# EAGLE design LOLRGB_3 (EAGLE 7.2.0)
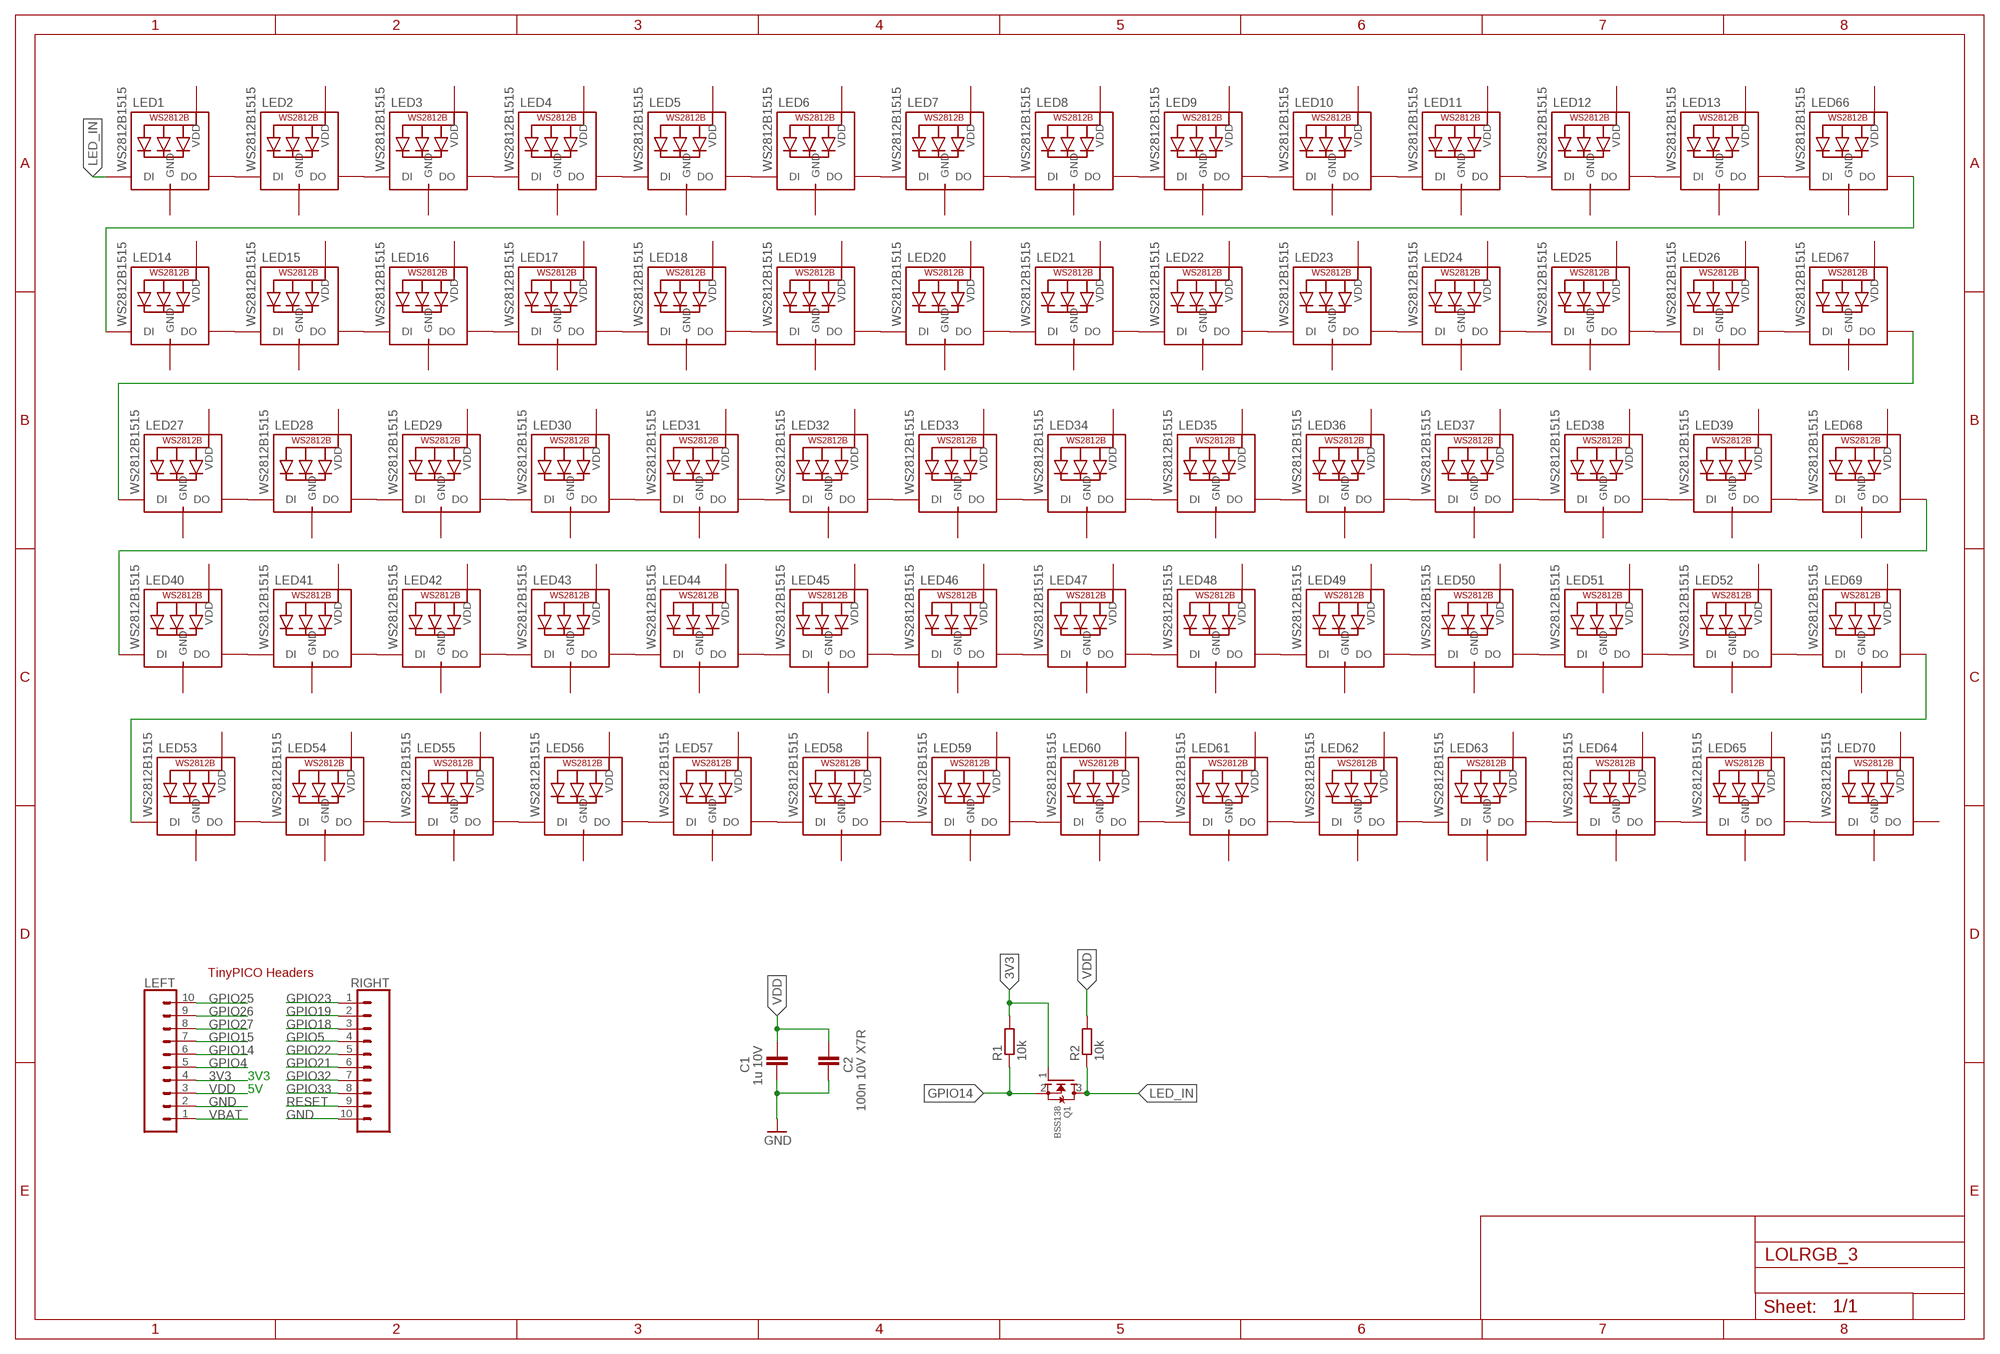
[diagram p0: schematic, sheet 1]

## Parts
C1  1u 10V  C-EUC0402_VISHAY  [C0402-VISHAY]
C2  100n 10V X7R  C-EUC0402_VISHAY  [C0402-VISHAY]
LED1  WS2812B1515  [LED1515]
LED2  WS2812B1515  [LED1515]
LED3  WS2812B1515  [LED1515]
LED4  WS2812B1515  [LED1515]
LED5  WS2812B1515  [LED1515]
LED6  WS2812B1515  [LED1515]
LED7  WS2812B1515  [LED1515]
LED8  WS2812B1515  [LED1515]
LED9  WS2812B1515  [LED1515]
LED10  WS2812B1515  [LED1515]
LED11  WS2812B1515  [LED1515]
LED12  WS2812B1515  [LED1515]
LED13  WS2812B1515  [LED1515]
LED14  WS2812B1515  [LED1515]
LED15  WS2812B1515  [LED1515]
LED16  WS2812B1515  [LED1515]
LED17  WS2812B1515  [LED1515]
LED18  WS2812B1515  [LED1515]
LED19  WS2812B1515  [LED1515]
LED20  WS2812B1515  [LED1515]
LED21  WS2812B1515  [LED1515]
LED22  WS2812B1515  [LED1515]
LED23  WS2812B1515  [LED1515]
LED24  WS2812B1515  [LED1515]
LED25  WS2812B1515  [LED1515]
LED26  WS2812B1515  [LED1515]
LED27  WS2812B1515  [LED1515]
LED28  WS2812B1515  [LED1515]
LED29  WS2812B1515  [LED1515]
LED30  WS2812B1515  [LED1515]
LED31  WS2812B1515  [LED1515]
LED32  WS2812B1515  [LED1515]
LED33  WS2812B1515  [LED1515]
LED34  WS2812B1515  [LED1515]
LED35  WS2812B1515  [LED1515]
LED36  WS2812B1515  [LED1515]
LED37  WS2812B1515  [LED1515]
LED38  WS2812B1515  [LED1515]
LED39  WS2812B1515  [LED1515]
LED40  WS2812B1515  [LED1515]
LED41  WS2812B1515  [LED1515]
LED42  WS2812B1515  [LED1515]
LED43  WS2812B1515  [LED1515]
LED44  WS2812B1515  [LED1515]
LED45  WS2812B1515  [LED1515]
LED46  WS2812B1515  [LED1515]
LED47  WS2812B1515  [LED1515]
LED48  WS2812B1515  [LED1515]
LED49  WS2812B1515  [LED1515]
LED50  WS2812B1515  [LED1515]
LED51  WS2812B1515  [LED1515]
LED52  WS2812B1515  [LED1515]
LED53  WS2812B1515  [LED1515]
LED54  WS2812B1515  [LED1515]
LED55  WS2812B1515  [LED1515]
LED56  WS2812B1515  [LED1515]
LED57  WS2812B1515  [LED1515]
LED58  WS2812B1515  [LED1515]
LED59  WS2812B1515  [LED1515]
LED60  WS2812B1515  [LED1515]
LED61  WS2812B1515  [LED1515]
LED62  WS2812B1515  [LED1515]
LED63  WS2812B1515  [LED1515]
LED64  WS2812B1515  [LED1515]
LED65  WS2812B1515  [LED1515]
LED66  WS2812B1515  [LED1515]
LED67  WS2812B1515  [LED1515]
LED68  WS2812B1515  [LED1515]
LED69  WS2812B1515  [LED1515]
LED70  WS2812B1515  [LED1515]
LEFT  TINYPICO_HEADER_10NO_SILK_PTH_FEMALE  [1X10_NO_SILK]
Q1  BSS138  MOSFET-NSOT23R  [SOT23-R]
R1  10k  R-EU_R0402-VISHAY  [ADAFRUIT_R0402-VISHAY]
R2  10k  R-EU_R0402-VISHAY  [ADAFRUIT_R0402-VISHAY]
RIGHT  TINYPICO_HEADER_10NO_SILK_PTH_FEMALE  [1X10_NO_SILK]

## Nets
3V3: LEFT.4 Q1.1(G) R1.2
GND: C1.2 C2.2 LEFT.2 RIGHT.10
GPIO4: LEFT.5
GPIO5: RIGHT.4
GPIO14: LEFT.6 Q1.2(S) R1.1
GPIO15: LEFT.7
GPIO18: RIGHT.3
GPIO19: RIGHT.2
GPIO21: RIGHT.6
GPIO22: RIGHT.5
GPIO23: RIGHT.1
GPIO25: LEFT.10
GPIO26: LEFT.9
GPIO27: LEFT.8
GPIO32: RIGHT.7
GPIO33: RIGHT.8
LED_IN: LED1.DIN(DI) Q1.3(D) R2.1
N$1: LED13.DOUT(DO) LED66.DIN(DI)
N$2: LED1.DOUT(DO) LED2.DIN(DI)
N$3: LED2.DOUT(DO) LED3.DIN(DI)
N$4: LED3.DOUT(DO) LED4.DIN(DI)
N$5: LED4.DOUT(DO) LED5.DIN(DI)
N$6: LED5.DOUT(DO) LED6.DIN(DI)
N$7: LED6.DOUT(DO) LED7.DIN(DI)
N$8: LED7.DOUT(DO) LED8.DIN(DI)
N$9: LED8.DOUT(DO) LED9.DIN(DI)
N$10: LED10.DOUT(DO) LED11.DIN(DI)
N$11: LED9.DOUT(DO) LED10.DIN(DI)
N$12: LED11.DOUT(DO) LED12.DIN(DI)
N$13: LED12.DOUT(DO) LED13.DIN(DI)
N$14: LED14.DOUT(DO) LED15.DIN(DI)
N$15: LED15.DOUT(DO) LED16.DIN(DI)
N$16: LED16.DOUT(DO) LED17.DIN(DI)
N$17: LED17.DOUT(DO) LED18.DIN(DI)
N$18: LED18.DOUT(DO) LED19.DIN(DI)
N$19: LED19.DOUT(DO) LED20.DIN(DI)
N$20: LED20.DOUT(DO) LED21.DIN(DI)
N$21: LED21.DOUT(DO) LED22.DIN(DI)
N$22: LED23.DOUT(DO) LED24.DIN(DI)
N$23: LED22.DOUT(DO) LED23.DIN(DI)
N$24: LED24.DOUT(DO) LED25.DIN(DI)
N$25: LED25.DOUT(DO) LED26.DIN(DI)
N$26: LED27.DOUT(DO) LED28.DIN(DI)
N$27: LED28.DOUT(DO) LED29.DIN(DI)
N$28: LED29.DOUT(DO) LED30.DIN(DI)
N$29: LED30.DOUT(DO) LED31.DIN(DI)
N$30: LED31.DOUT(DO) LED32.DIN(DI)
N$31: LED32.DOUT(DO) LED33.DIN(DI)
N$32: LED33.DOUT(DO) LED34.DIN(DI)
N$33: LED34.DOUT(DO) LED35.DIN(DI)
N$34: LED36.DOUT(DO) LED37.DIN(DI)
N$35: LED35.DOUT(DO) LED36.DIN(DI)
N$36: LED37.DOUT(DO) LED38.DIN(DI)
N$37: LED38.DOUT(DO) LED39.DIN(DI)
N$38: LED40.DOUT(DO) LED41.DIN(DI)
N$39: LED41.DOUT(DO) LED42.DIN(DI)
N$40: LED42.DOUT(DO) LED43.DIN(DI)
N$41: LED43.DOUT(DO) LED44.DIN(DI)
N$42: LED44.DOUT(DO) LED45.DIN(DI)
N$43: LED45.DOUT(DO) LED46.DIN(DI)
N$44: LED46.DOUT(DO) LED47.DIN(DI)
N$45: LED47.DOUT(DO) LED48.DIN(DI)
N$46: LED49.DOUT(DO) LED50.DIN(DI)
N$47: LED48.DOUT(DO) LED49.DIN(DI)
N$48: LED50.DOUT(DO) LED51.DIN(DI)
N$49: LED51.DOUT(DO) LED52.DIN(DI)
N$50: LED53.DOUT(DO) LED54.DIN(DI)
N$51: LED54.DOUT(DO) LED55.DIN(DI)
N$52: LED55.DOUT(DO) LED56.DIN(DI)
N$53: LED56.DOUT(DO) LED57.DIN(DI)
N$54: LED57.DOUT(DO) LED58.DIN(DI)
N$55: LED58.DOUT(DO) LED59.DIN(DI)
N$56: LED59.DOUT(DO) LED60.DIN(DI)
N$57: LED60.DOUT(DO) LED61.DIN(DI)
N$58: LED62.DOUT(DO) LED63.DIN(DI)
N$59: LED61.DOUT(DO) LED62.DIN(DI)
N$60: LED63.DOUT(DO) LED64.DIN(DI)
N$61: LED64.DOUT(DO) LED65.DIN(DI)
N$62: LED14.DIN(DI) LED66.DOUT(DO)
N$63: LED26.DOUT(DO) LED67.DIN(DI)
N$64: LED39.DOUT(DO) LED68.DIN(DI)
N$65: LED52.DOUT(DO) LED69.DIN(DI)
N$66: LED65.DOUT(DO) LED70.DIN(DI)
N$67: LED27.DIN(DI) LED67.DOUT(DO)
N$68: LED40.DIN(DI) LED68.DOUT(DO)
N$69: LED53.DIN(DI) LED69.DOUT(DO)
RESET: RIGHT.9
VBAT: LEFT.1
VDD: C1.1 C2.1 LEFT.3 R2.2
Unconnected: LED70.DOUT(DO)

## Notes on the sheet
- TinyPICO Headers
- 3V3
- 5V

## Power pins joined to a net without a drawn wire
GND: LED1.GND LED2.GND LED3.GND LED4.GND LED5.GND LED6.GND LED7.GND LED8.GND LED9.GND LED10.GND LED11.GND LED12.GND LED13.GND LED14.GND LED15.GND LED16.GND LED17.GND LED18.GND LED19.GND LED20.GND LED21.GND LED22.GND LED23.GND LED24.GND LED25.GND LED26.GND LED27.GND LED28.GND LED29.GND LED30.GND LED31.GND LED32.GND LED33.GND LED34.GND LED35.GND LED36.GND LED37.GND LED38.GND LED39.GND LED40.GND LED41.GND LED42.GND LED43.GND LED44.GND LED45.GND LED46.GND LED47.GND LED48.GND LED49.GND LED50.GND LED51.GND LED52.GND LED53.GND LED54.GND LED55.GND LED56.GND LED57.GND LED58.GND LED59.GND LED60.GND LED61.GND LED62.GND LED63.GND LED64.GND LED65.GND LED66.GND LED67.GND LED68.GND LED69.GND LED70.GND
VDD: LED1.VDD LED2.VDD LED3.VDD LED4.VDD LED5.VDD LED6.VDD LED7.VDD LED8.VDD LED9.VDD LED10.VDD LED11.VDD LED12.VDD LED13.VDD LED14.VDD LED15.VDD LED16.VDD LED17.VDD LED18.VDD LED19.VDD LED20.VDD LED21.VDD LED22.VDD LED23.VDD LED24.VDD LED25.VDD LED26.VDD LED27.VDD LED28.VDD LED29.VDD LED30.VDD LED31.VDD LED32.VDD LED33.VDD LED34.VDD LED35.VDD LED36.VDD LED37.VDD LED38.VDD LED39.VDD LED40.VDD LED41.VDD LED42.VDD LED43.VDD LED44.VDD LED45.VDD LED46.VDD LED47.VDD LED48.VDD LED49.VDD LED50.VDD LED51.VDD LED52.VDD LED53.VDD LED54.VDD LED55.VDD LED56.VDD LED57.VDD LED58.VDD LED59.VDD LED60.VDD LED61.VDD LED62.VDD LED63.VDD LED64.VDD LED65.VDD LED66.VDD LED67.VDD LED68.VDD LED69.VDD LED70.VDD

## Library data of the parts
C1 C2 = rcl:C-EU: CAPACITOR, European symbol
LED1-LED70 = adafruit:WS2812B
LEFT RIGHT = UnexpectedMaker:TINYPICO_HEADER_10: Multi connection point. Often used as Generic Header-pin footprint for 0.1 inch spaced/style header connections On any of the 0.1 inch spaced packages, you can populate with these: Break Away Headers - Straight <https://www.sparkfun.com/products/116> (PRT-00116) Break Away Male Headers - Right Angle <https://www.sparkfun.com/products/553> (PRT-00553) Female Headers <https://www.sparkfun.com/products/115> (PRT-00115) Break Away Headers - Machine Pin <https://www.sparkfun.com/products/117> (PRT-00117) Break Away Female Headers - Swiss Machine Pin <https://www.sparkfun.com/products/743> (PRT-00743) Arduino Stackable Header - 10 Pin <https://www.sparkfun.com/products/11376> (PRT-11376) For SCREWTERMINALS and SPRING TERMINALS visit here: Screw Terimnals on SparkFun.com <https://www.sparkfun.com/search/results?term=Screw+Terminals> (5mm/3.5mm/2.54mm spacing) This device is also useful as a general connection point to wire up your design to another part of your project. Our various solder wires solder well into these plated through hole pads. Hook-Up Wire - Assortment (Stranded, 22 AWG) <https://www.sparkfun.com/products/11375> (PRT-11375) Hook-Up Wire - Assortment (Solid Core, 22 AWG) <https://www.sparkfun.com/products/11367> (PRT-11367) View the entire wire category on our website here <https://www.sparkfun.com/categories/141> Special notes: Molex polarized connector foot print use with SKU : PRT-08231 with associated crimp pins and housings. 1MM SMD Version SKU: PRT-10208 NOTES ON THE VARIANTS LOCK and LOCK_LONGPADS... This footprint was designed to help hold the alignment of a through-hole component (i.e. 6-pin header) while soldering it into place. You may notice that each hole has been shifted either up or down by 0.005 of an inch from it's more standard position (which is a perfectly straight line). This slight alteration caused the pins (the squares in the middle) to touch the edges of the holes. Because they are alternating, it causes a "brace" to hold the component in place. 0.005 has proven to be the perfect amount of "off-center" position when using our standard breakaway headers. Although looks a little odd when you look at the bare footprint, once you have a header in there, the alteration is very hard to notice. Also,if you push a header all the way into place, it is covered up entirely on the bottom side.; PROD_ID: CONN-11563
Q1 = adafruit:MOSFET-N: N-Channel Mosfet 2N7002E - 60V 260mA SOT23 [Digikey: 2N7002ET1GOSTR-ND] - REEL BSH103 - 30V 850mA SOT23 [Digikey: 568-5013-1-ND]
R1 R2 = rcl:R-EU_: RESISTOR, European symbol

## Board
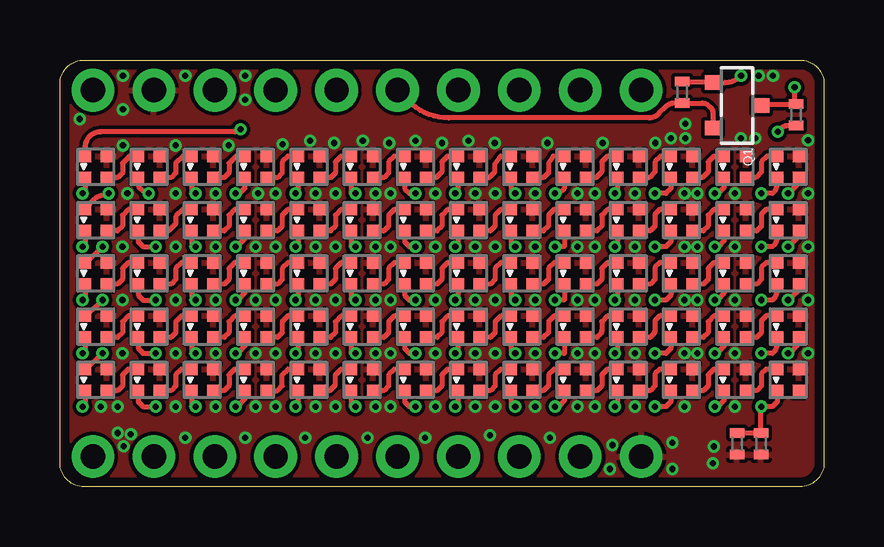
[diagram p1: board, top side]
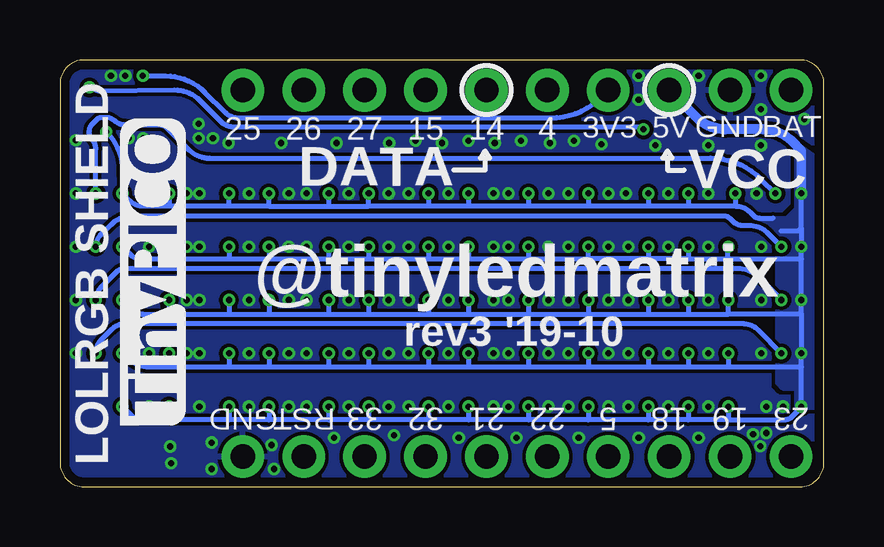
[diagram p2: board, bottom side, seen from below]

Size 31.85 x 17.78 mm. Coordinates in mm from the lower left corner, seen from the top.
Outline: 31.85,16.78 31.85,1 arc-90 30.85,0 1,0 arc-90 0,1 0,16.78 arc-90 1,17.78 30.85,17.78 arc-90 31.85,16.78
Copper layers (1*16): Top 0.035559375mm / dielectric 1.6mm / Bottom 0.035559375mm
Design rules "oshpark-2layer *": minimum track width 6mil, minimum drill 10mil, track to track 6mil, track to pad 6mil, pad to pad 6mil, via to via 6mil, smd to smd 6mil, copper to edge 15mil, drill to drill 6mil, minimum pad ring 5mil, minimum via ring 5mil, stop-mask expansion 2.5mil, vias tented up to drill 10mil, thermal gap 6mil

### Footprints (pad centres in the part's own frame; a part is rotated, then mirrored left to right if it is on the bottom)
C0402-VISHAY = smd 0.4 x 0.6: 1 -0.45,0; 2 0.45,0
LED1515 = smd 0.5 x 0.5: DIN 0.45,0.45; DOUT -0.45,-0.45; GND 0.45,-0.45; VDD -0.45,0.45
1X10_NO_SILK = drill 1.016 pad 1.778: 1 0,0; 2 2.54,0; 3 5.08,0; 4 7.62,0; 5 10.16,0; 6 12.7,0; 7 15.24,0; 8 17.78,0; 9 20.32,0; 10 22.86,0
SOT23-R = smd 0.6 x 0.7: 1 -0.95,-1; 2 0.95,-1; 3 0,1
ADAFRUIT_R0402-VISHAY = smd 0.4 x 0.6: 1 -0.45,0; 2 0.45,0

### Placement (x,y rotation side)
C1  29.23,1.79 270 top
C2  28.23,1.79 270 top
LED1  1.5,13.33 90 top
LED2  3.72,13.33 90 top
LED3  5.94,13.33 90 top
LED4  8.16,13.33 90 top
LED5  10.38,13.33 90 top
LED6  12.6,13.33 90 top
LED7  14.82,13.33 90 top
LED8  17.04,13.33 90 top
LED9  19.26,13.33 90 top
LED10  21.48,13.33 90 top
LED11  23.7,13.33 90 top
LED12  25.92,13.33 90 top
LED13  28.14,13.33 90 top
LED14  1.5,11.11 90 top
LED15  3.72,11.11 90 top
LED16  5.94,11.11 90 top
LED17  8.16,11.11 90 top
LED18  10.38,11.11 90 top
LED19  12.6,11.11 90 top
LED20  14.82,11.11 90 top
LED21  17.04,11.11 90 top
LED22  19.26,11.11 90 top
LED23  21.48,11.11 90 top
LED24  23.7,11.11 90 top
LED25  25.92,11.11 90 top
LED26  28.14,11.11 90 top
LED27  1.5,8.89 90 top
LED28  3.72,8.89 90 top
LED29  5.94,8.89 90 top
LED30  8.16,8.89 90 top
LED31  10.38,8.89 90 top
LED32  12.6,8.89 90 top
LED33  14.82,8.89 90 top
LED34  17.04,8.89 90 top
LED35  19.26,8.89 90 top
LED36  21.48,8.89 90 top
LED37  23.7,8.89 90 top
LED38  25.92,8.89 90 top
LED39  28.14,8.89 90 top
LED40  1.5,6.67 90 top
LED41  3.72,6.67 90 top
LED42  5.94,6.67 90 top
LED43  8.16,6.67 90 top
LED44  10.38,6.67 90 top
LED45  12.6,6.67 90 top
LED46  14.82,6.67 90 top
LED47  17.04,6.67 90 top
LED48  19.26,6.67 90 top
LED49  21.48,6.67 90 top
LED50  23.7,6.67 90 top
LED51  25.92,6.67 90 top
LED52  28.14,6.67 90 top
LED53  1.5,4.45 90 top
LED54  3.72,4.45 90 top
LED55  5.94,4.45 90 top
LED56  8.16,4.45 90 top
LED57  10.38,4.45 90 top
LED58  12.6,4.45 90 top
LED59  14.82,4.45 90 top
LED60  17.04,4.45 90 top
LED61  19.26,4.45 90 top
LED62  21.48,4.45 90 top
LED63  23.7,4.45 90 top
LED64  25.92,4.45 90 top
LED65  28.14,4.45 90 top
LED66  30.36,13.33 90 top
LED67  30.36,11.11 90 top
LED68  30.36,8.89 90 top
LED69  30.36,6.67 90 top
LED70  30.36,4.45 90 top
LEFT  1.37,16.52 0 top
Q1  28.23,15.89 270 top
R1  25.94,16.43 90 top
R2  30.69,15.49 270 top
RIGHT  1.37,1.26 0 top

### Tracks (layer width: path | path; a pad name or v marks a point on that pad's centre or on a via)
3V3  (via drill 0.25)
  Top 0.2: R1.2 27.17,16.88 Q1.1 27.72,16.84 arc45 v28.4,17.12
  Bottom 0.2: v28.4,17.12 27.45,17.12 arc45 25.81,16.44 24.98,15.6 arc-45 24.4,15.37 11.41,15.37 arc-45 9.26,16.26 LEFT.4
GND  (via drill 0.25 pad 0.5, 0.25 pad 0.51)
  other vias: 28.14,10 31.19,10 26.04,10 23.97,10 21.58,10 19.81,10 19.81,12.22 21.58,12.22 23.97,12.22 26.04,12.22 28.14,12.22 28.14,7.78 31.19,7.78 31.19,12.22 31.19,5.56 28.14,5.56 26.04,5.56 23.97,5.56 21.58,5.56 19.81,5.56 17.31,5.56 15.65,5.56 13.15,5.56 11.49,5.56 8.16,5.56 6.49,5.56 4.83,5.56 4.83,7.78 6.49,7.78 8.99,7.78 11.49,7.78 13.15,7.78 15.65,7.78 17.31,7.78 19.81,7.78 21.58,7.78 23.97,7.78 26.04,7.78 17.31,10 15.65,10 13.15,10 10.65,10 8.16,10 6.49,10 4.83,10 2.81,12.22 4.83,12.22 6.49,12.22 8.99,12.22 10.65,12.22 13.15,12.22 15.65,12.22 17.31,12.22 8.26,12.22 13.78,12.22 18.15,12.22 22.31,12.22 26.57,12.22 8.99,10 13.78,10 18.15,10 22.31,10 26.57,10 26.57,7.78 22.31,7.78 18.15,7.78 13.78,7.78 8.16,7.78 8.99,5.56 13.78,5.56 18.15,5.56 22.31,5.56 26.57,5.56 11.49,12.22 11.49,10 10.65,5.56 10.65,7.78 2.61,7.78 2.61,10 2.61,5.56 31.19,14.44 15.65,3.34 17.31,3.34 18.15,3.34 19.81,3.34 21.58,3.34 22.31,3.34 23.97,3.34 26.04,3.34 28.14,3.34 27.21,0.98 27.26,1.68 13.78,3.34 13.15,3.34 11.49,3.34 10.65,3.34 8.99,3.34 8.16,3.34 6.49,3.34 4.83,3.34 2.41,3.34 1.71,3.34 2.41,2.24 2.66,1.69 2.96,2.19 5.23,2.04 7.73,2.04 10.23,2.04 12.83,2.04 15.23,2.04 17.93,2.14 20.43,2.04 23.03,1.74 22.93,0.74 25.53,1.84 25.53,0.74 28.99,14.52 28.39,14.52 2.63,15.72 2.63,14.22 4.83,14.22 7.03,14.22 9.28,14.27 11.43,14.32 13.73,14.32 15.93,14.32 18.13,14.32 20.33,14.32 22.63,14.32 24.83,14.32 5.23,17.12 7.73,17.12 7.73,16.12 0.83,15.32 2.63,17.12 10.43,14.42 12.63,14.42 14.83,14.42 17.03,14.42 26.08,14.52 29.13,17.12 29.73,17.12 26.08,15.12 25.48,14.52
  pour Top: -1.41,15.88 -1.41,-2.55 32.17,-0.33 32.17,18.08 -0.84,18.08
  pour Bottom (rank 2): 32.38,18.41 32.38,-0.63 -1.27,-0.63 -1.27,18.41
GPIO14
  Top 0.2: LEFT.6 14.54,16.05 arc45 16.2,15.37 24.56,15.37 arc45 24.96,15.53 25.27,15.85 arc-45 25.59,15.98 R1.1 26.76,15.98 arc-45 27.07,15.86 27.13,15.79 arc-45 27.22,15.58 27.23,15.58 Q1.2
LED_IN  (via drill 0.25)
  Top 0.2: R2.1 | R2.1 30.63,16.01 v30.63,16.64 | LED1.DIN 1.05,14.14 arc-90 1.7,14.79 7.28,14.79 arc45 v7.53,14.89 | Q1.3 29.27,15.95 R2.1
  Bottom 0.2: v30.63,16.64 30.54,16.64 arc45 30.43,16.6 arc-46 30.17,16.49 27.08,16.53 arc46 26.05,16.11 25.17,15.24 arc-45 24.57,14.99 7.77,14.99 arc45 v7.53,14.89
N$1
  Top 0.2: LED66.DIN 29.49,13.78 29.25,13.54 29.25,13.12 29.01,12.88 LED13.DOUT
N$2
  Top 0.2: LED2.DIN 2.91,13.78 2.61,13.48 2.61,13.08 2.41,12.88 LED1.DOUT
N$3
  Top 0.2: LED3.DIN 5.13,13.78 4.83,13.48 4.83,13.08 4.63,12.88 LED2.DOUT
N$4
  Top 0.2: LED4.DIN 7.35,13.78 7.05,13.48 7.05,13.08 6.85,12.88 LED3.DOUT
N$5
  Top 0.2: LED5.DIN 9.51,13.78 9.27,13.54 9.27,13.08 9.07,12.88 LED4.DOUT
N$6
  Top 0.2: LED6.DIN 11.73,13.78 11.49,13.54 11.49,13.08 11.29,12.88 LED5.DOUT
N$7
  Top 0.2: LED7.DIN 13.95,13.78 13.71,13.54 13.71,13.08 13.51,12.88 LED6.DOUT
N$8
  Top 0.2: LED8.DIN 16.17,13.78 15.93,13.54 15.93,13.12 15.69,12.88 LED7.DOUT
N$9
  Top 0.2: LED8.DOUT 17.89,12.88 18.13,13.12 18.13,13.44 18.37,13.78 LED9.DIN
N$10
  Top 0.2: LED11.DIN 22.83,13.78 22.59,13.54 22.59,13.12 22.35,12.88 LED10.DOUT
N$11
  Top 0.2: LED10.DIN 20.57,13.78 20.37,13.48 20.37,13.08 20.17,12.88 LED9.DOUT
N$12
  Top 0.2: LED12.DIN 25.05,13.78 24.81,13.54 24.81,13.12 24.57,12.88 LED11.DOUT
N$13
  Top 0.2: LED13.DIN 27.27,13.78 27.03,13.54 27.03,13.12 26.79,12.88 LED12.DOUT
N$14
  Top 0.2: LED15.DIN 2.85,11.56 2.61,11.32 2.61,10.86 2.41,10.66 LED14.DOUT
N$15
  Top 0.2: LED16.DIN 5.13,11.56 4.83,11.26 4.83,10.96 4.53,10.66 LED15.DOUT
N$16
  Top 0.2: LED17.DIN 7.29,11.56 7.05,11.32 7.05,10.86 6.85,10.66 LED16.DOUT
N$17
  Top 0.2: LED18.DIN 9.51,11.56 9.27,11.32 9.27,10.86 9.07,10.66 LED17.DOUT
N$18
  Top 0.2: LED19.DIN 11.73,11.56 11.49,11.32 11.49,10.86 11.29,10.66 LED18.DOUT
N$19
  Top 0.2: LED20.DIN 13.95,11.56 13.71,11.32 13.71,10.86 13.51,10.66 LED19.DOUT
N$20
  Top 0.2: LED21.DIN 16.17,11.56 15.93,11.32 15.93,10.86 15.73,10.66 LED20.DOUT
N$21
  Top 0.2: LED22.DIN 18.39,11.56 18.15,11.32 18.15,10.86 17.95,10.66 LED21.DOUT
N$22
  Top 0.2: LED24.DIN 22.83,11.56 22.59,11.32 22.59,10.86 22.39,10.66 LED23.DOUT
N$23
  Top 0.2: LED23.DIN 20.61,11.56 20.37,11.32 20.37,10.86 20.17,10.66 LED22.DOUT
N$24
  Top 0.2: LED25.DIN 25.01,11.56 24.81,11.36 24.81,10.86 24.61,10.66 LED24.DOUT
N$25
  Top 0.2: LED26.DIN 27.27,11.56 27.03,11.32 27.03,10.86 26.83,10.66 LED25.DOUT
N$26
  Top 0.2: LED28.DIN 2.85,9.34 2.61,9.1 2.61,8.64 2.41,8.44 LED27.DOUT
N$27
  Top 0.2: LED29.DIN 5.07,9.34 4.83,9.1 4.83,8.64 4.63,8.44 LED28.DOUT
N$28
  Top 0.2: LED30.DIN 7.29,9.34 7.05,9.1 7.05,8.64 6.85,8.44 LED29.DOUT
N$29
  Top 0.2: LED31.DIN 9.51,9.34 9.27,9.1 9.27,8.64 9.07,8.44 LED30.DOUT
N$30
  Top 0.2: LED32.DIN 11.73,9.34 11.49,9.1 11.49,8.64 11.29,8.44 LED31.DOUT
N$31
  Top 0.2: LED33.DIN 13.95,9.34 13.71,9.1 13.71,8.64 13.51,8.44 LED32.DOUT
N$32
  Top 0.2: LED34.DIN 16.17,9.34 15.93,9.1 15.93,8.64 15.73,8.44 LED33.DOUT
N$33
  Top 0.2: LED35.DIN 18.39,9.34 18.15,9.1 18.15,8.64 17.95,8.44 LED34.DOUT
N$34
  Top 0.2: LED37.DIN 22.83,9.34 22.59,9.1 22.59,8.64 22.39,8.44 LED36.DOUT
N$35
  Top 0.2: LED36.DIN 20.61,9.34 20.37,9.1 20.37,8.64 20.17,8.44 LED35.DOUT
N$36
  Top 0.2: LED38.DIN 25.01,9.34 24.81,9.14 24.81,8.64 24.61,8.44 LED37.DOUT
N$37
  Top 0.2: LED39.DIN 27.27,9.34 27.03,9.1 27.03,8.64 26.83,8.44 LED38.DOUT
N$38
  Top 0.2: LED41.DIN 2.85,7.12 2.61,6.88 2.61,6.42 2.41,6.22 LED40.DOUT
N$39
  Top 0.2: LED42.DIN 5.07,7.12 4.83,6.88 4.83,6.42 4.63,6.22 LED41.DOUT
N$40
  Top 0.2: LED43.DIN 7.29,7.12 7.05,6.88 7.05,6.42 6.85,6.22 LED42.DOUT
N$41
  Top 0.2: LED44.DIN 9.51,7.12 9.27,6.88 9.27,6.42 9.07,6.22 LED43.DOUT
N$42
  Top 0.2: LED45.DIN 11.73,7.12 11.49,6.88 11.49,6.42 11.29,6.22 LED44.DOUT
N$43
  Top 0.2: LED46.DIN 13.95,7.12 13.71,6.88 13.71,6.42 13.51,6.22 LED45.DOUT
N$44
  Top 0.2: LED47.DIN 16.17,7.12 15.93,6.88 15.93,6.42 15.73,6.22 LED46.DOUT
N$45
  Top 0.2: LED48.DIN 18.39,7.12 18.15,6.88 18.15,6.42 17.95,6.22 LED47.DOUT
N$46
  Top 0.2: LED50.DIN 22.83,7.12 22.59,6.88 22.59,6.5 22.53,6.36 22.39,6.22 LED49.DOUT
N$47
  Top 0.2: LED49.DIN 20.61,7.12 20.37,6.88 20.37,6.42 20.17,6.22 LED48.DOUT
N$48
  Top 0.2: LED51.DIN 25.01,7.12 24.81,6.92 24.81,6.5 24.75,6.36 24.61,6.22 LED50.DOUT
N$49
  Top 0.2: LED52.DIN 27.27,7.12 27.03,6.88 27.03,6.42 26.83,6.22 LED51.DOUT
N$50
  Top 0.2: LED54.DIN 2.85,4.9 2.61,4.66 2.61,4.2 2.41,4 LED53.DOUT
N$51
  Top 0.2: LED55.DIN 5.07,4.9 4.83,4.66 4.83,4.2 4.63,4 LED54.DOUT
N$52
  Top 0.2: LED56.DIN 7.29,4.9 7.05,4.66 7.05,4.2 6.85,4 LED55.DOUT
N$53
  Top 0.2: LED56.DOUT 9.07,4 9.27,4.2 9.27,4.66 9.51,4.9 LED57.DIN
N$54
  Top 0.2: LED57.DOUT 11.25,4 11.49,4.24 11.49,4.66 11.73,4.9 LED58.DIN
N$55
  Top 0.2: LED59.DIN 13.95,4.9 13.71,4.66 13.71,4.2 13.51,4 LED58.DOUT
N$56
  Top 0.2: LED60.DIN 16.17,4.9 15.93,4.66 15.93,4.2 15.73,4 LED59.DOUT
N$57
  Top 0.2: LED61.DIN 18.39,4.9 18.15,4.66 18.15,4.2 17.95,4 LED60.DOUT
N$58
  Top 0.2: LED63.DIN 22.83,4.9 22.59,4.66 22.59,4.2 22.39,4 LED62.DOUT
N$59
  Top 0.2: LED62.DIN 20.61,4.9 20.37,4.66 20.37,4.2 20.17,4 LED61.DOUT
N$60
  Top 0.2: LED64.DIN 25.01,4.9 24.81,4.7 24.81,4.2 24.61,4 LED63.DOUT
N$61
  Top 0.2: LED65.DIN 27.27,4.9 27.03,4.66 27.03,4.2 26.83,4 LED64.DOUT
N$62  (via drill 0.25 pad 0.51)
  Top 0.2: v30.36,12.22 30.38,12.22 30.73,12.57 30.73,12.88 LED66.DOUT | LED14.DIN 1.37,11.92 arc-34 1.72,12.14 v2.03,12.22
  Bottom 0.2: v2.03,12.22 2.63,12.82 arc-45 4.73,13.69 25.63,13.69 arc45 26.48,14.04 27.34,14.9 arc-45 27.79,15.09 29.15,15.09 arc45 29.62,15.28 arc-45 29.97,15.39 30.11,15.39 arc-45 30.31,15.31 30.51,15.11 arc-45 30.63,14.82 30.63,14.72 arc-45 30.53,14.5 arc45 30.36,14.07 v30.36,12.22
N$63
  Top 0.2: LED67.DIN 29.45,11.56 29.25,11.36 29.25,10.86 29.05,10.66 LED26.DOUT
N$64
  Top 0.2: LED68.DIN 29.45,9.34 29.25,9.14 29.25,8.64 29.05,8.44 LED39.DOUT
N$65
  Top 0.2: LED69.DIN 29.45,7.12 29.25,6.92 29.25,6.42 29.05,6.22 LED52.DOUT
N$66
  Top 0.2: LED70.DIN 29.45,4.9 29.25,4.7 29.25,4.2 29.05,4 LED65.DOUT
N$67  (via drill 0.25 pad 0.51)
  Top 0.2: LED27.DIN v1.77,10 | v30.36,10 30.37,10 30.73,10.36 30.73,10.66 LED67.DOUT
  Bottom 0.2: v30.36,10 arc45 30.15,10.5 29.74,10.9 arc45 28.81,11.29 4.2,11.29 arc45 3.9,11.17 3.78,11.04 arc-45 3.42,10.89 3.13,10.89 arc45 2.34,10.56 v1.77,10
N$68  (via drill 0.25 pad 0.51)
  Top 0.2: v30.36,7.78 30.41,7.78 30.73,8.1 30.73,8.44 LED68.DOUT | LED40.DIN v1.77,7.78
  Bottom 0.2: v30.36,7.78 arc45 30.14,8.31 29.51,8.94 arc45 29.14,9.09 3.62,9.09 arc45 2.69,8.71 1.77,7.79 v1.77,7.78
N$69  (via drill 0.25 pad 0.51)
  Top 0.2: LED69.DOUT 30.81,6.09 30.73,6.09 30.73,5.87 30.42,5.56 v30.36,5.56 | LED53.DIN v1.77,5.56
  Bottom 0.2: v1.77,5.56 2.7,6.49 arc-45 3.42,6.79 29.14,6.79 arc-45 29.67,6.58 30.13,6.12 arc-45 v30.36,5.56
VDD  (via drill 0.25 pad 0.51)
  Top 0.2: LED53.VDD 1.05,3.45 v0.94,3.34 | LED40.VDD 1.05,5.67 v0.94,5.56 | LED41.VDD 3.27,5.76 3.47,5.56 v3.99,5.56 | LED42.VDD 5.49,5.56 v5.66,5.56 | LED43.VDD 7.71,5.87 7.4,5.56 v7.32,5.56 | LED44.VDD 9.93,5.56 v9.82,5.56 | LED45.VDD 12.15,5.56 v12.32,5.56 | LED46.VDD 14.37,5.76 14.57,5.56 v14.82,5.56 | LED15.VDD 3.27,10.2 3.47,10 v3.99,10 | LED14.VDD 1.05,10 v0.94,10 | LED27.VDD 1.05,7.78 v0.94,7.78 | LED28.VDD 3.27,7.98 3.47,7.78 v3.99,7.78 | LED29.VDD 5.49,7.78 v5.66,7.78 | LED16.VDD 5.49,10 v5.66,10 | LED17.VDD 7.71,10.34 7.37,10 v7.32,10 | LED30.VDD 7.71,8.08 7.4,7.78 v7.32,7.78 | LED4.VDD 7.71,12.43 7.5,12.22 v7.32,12.22 | LED3.VDD 5.49,12.22 v5.66,12.22 | LED2.VDD 3.27,12.52 3.57,12.22 v3.69,12.22 | LED5.VDD 9.93,12.22 v9.82,12.22 | LED7.VDD 14.37,12.42 14.57,12.22 v14.82,12.22 | LED11.VDD 23.25,12.22 v23.14,12.22 | LED10.VDD 21.03,12.42 20.83,12.22 v20.64,12.22 | LED62.VDD 21.03,3.59 20.77,3.34 v20.64,3.34 | LED63.VDD 23.25,3.34 v23.14,3.34 | LED64.VDD 25.47,3.54 25.27,3.34 v24.81,3.34 | LED51.VDD 25.47,5.76 25.27,5.56 v24.81,5.56 | LED52.VDD 27.69,5.85 27.39,5.56 v27.3,5.56 | LED65.VDD 27.69,3.59 27.43,3.34 v27.3,3.34 | LED70.VDD 29.91,3.54 29.71,3.34 v29.25,3.34 29.23,3.32 C1.1 C2.1 | LED69.VDD 29.91,5.92 29.79,5.65 29.71,5.56 v29.25,5.56 | LED36.VDD 21.03,7.78 v20.64,7.78 | LED37.VDD 23.25,7.78 v23.14,7.78 | LED38.VDD 25.47,7.98 25.27,7.78 v24.81,7.78 | LED39.VDD 27.69,8.06 27.4,7.78 v27.3,7.78 | LED68.VDD 29.91,8.14 29.79,7.87 29.71,7.78 v29.25,7.78 | LED67.VDD 29.91,10.36 29.79,10.09 29.71,10 v29.25,10 | LED26.VDD 27.69,10.24 27.45,10 v27.3,10 | LED25.VDD 25.47,10.2 25.27,10 v24.81,10
  Top 0.2: LED23.VDD 21.03,10 v20.64,10 | LED22.VDD 18.81,10 v18.98,10 | LED21.VDD 16.59,10 v16.48,10 | LED34.VDD 16.59,7.78 v16.48,7.78 | LED35.VDD 18.81,7.78 v18.98,7.78 | LED47.VDD 16.59,5.56 v16.48,5.56 | LED48.VDD 18.81,5.56 v18.98,5.56 | LED49.VDD 21.03,5.56 v20.64,5.56 | LED50.VDD 23.25,5.56 v23.14,5.56 | LED61.VDD 18.81,3.34 v18.98,3.34 | LED60.VDD 16.59,3.34 v16.48,3.34 | LED12.VDD 25.47,12.42 25.27,12.22 v24.81,12.22 | LED13.VDD 27.69,12.46 27.45,12.22 v27.3,12.22 | LED66.VDD 29.91,12.58 29.79,12.31 29.71,12.22 v29.25,12.22 | LED20.VDD 14.37,10.2 14.57,10 v14.82,10 | LED19.VDD 12.15,10 v12.32,10 | LED32.VDD 12.15,7.78 v12.32,7.78 | LED33.VDD 14.37,7.98 14.57,7.78 v14.82,7.78 | LED58.VDD 12.15,3.34 v12.32,3.34 | LED59.VDD 14.37,3.54 14.57,3.34 v14.82,3.34 | LED1.VDD 1.05,12.22 v0.94,12.22 | LED54.VDD 3.27,3.54 3.47,3.34 v3.99,3.34 | LED55.VDD 5.49,3.34 v5.66,3.34 | LED56.VDD 7.71,3.66 7.39,3.34 v7.32,3.34 | LED57.VDD 9.93,3.34 v9.82,3.34 | LED31.VDD 9.93,7.78 v9.82,7.78 | LED18.VDD 9.93,10 v9.82,10 | LED24.VDD 23.25,10 v23.14,10 | LED6.VDD 12.15,12.22 v12.32,12.22 | LED8.VDD 16.59,12.22 v16.48,12.22 | LED9.VDD 18.81,12.22 v18.98,12.22 | R2.2 30.34,15.05 arc45 30.07,14.93 v29.93,14.79
  Bottom 0.2: v7.32,10 7.32,9.49 | 23.14,11.69 24.83,11.69 | 24.83,11.69 27.3,11.69 | 23.14,11.69 v23.14,12.22 | v24.81,12.22 24.83,12.22 24.83,11.69 | 7.32,9.49 9.82,9.49 | 9.82,9.49 v9.82,10 | v12.32,10 12.32,9.49 | 12.32,9.49 9.82,9.49 | v5.66,10 5.66,9.49 | 5.66,9.49 7.32,9.49 | v14.82,10 14.82,9.49 | 14.82,9.49 12.32,9.49 | v16.48,10 16.48,9.49 | 16.48,9.49 14.82,9.49 | v18.98,10 18.98,9.49 | 18.98,9.49 16.48,9.49 | v20.64,10 20.64,9.49 | 20.64,9.49 18.98,9.49 | v23.14,10 23.14,9.49 | 23.14,9.49 20.64,9.49 | v24.81,10 24.81,9.49 | 24.81,9.49 23.14,9.49 | v29.25,10 28.93,9.69 arc-45 28.45,9.49 27.3,9.49 | 27.3,9.49 24.81,9.49 | v27.3,10 27.3,9.49 | 0.94,10.77 v0.94,10 | 0.94,7.19 3.99,7.19 | 3.99,7.19 v3.99,7.78 | v5.66,7.78 5.66,7.19 | 5.66,7.19 3.99,7.19 | v7.32,7.78 7.32,7.19 | 7.32,7.19 5.66,7.19 | v9.82,7.78 9.82,7.19 | 9.82,7.19 7.32,7.19 | v12.32,7.78 12.32,7.19 | 12.32,7.19 9.82,7.19 | v14.82,7.78 14.82,7.19 | 14.82,7.19 12.32,7.19 | v18.98,7.78 18.98,7.19 | 18.98,7.19 16.48,7.19 | 16.48,7.19 14.82,7.19 | v16.48,7.78 16.48,7.19 | v20.64,7.78 20.64,7.19 | 20.64,7.19 18.98,7.19 | v23.14,7.78 23.14,7.19 | 23.14,7.19 20.64,7.19 | v24.81,7.78 24.81,7.19 | 24.81,7.19 23.14,7.19 | v27.3,7.78 27.3,7.19 | 27.3,7.19 24.81,7.19 | v29.25,7.78 28.83,7.37 arc-45 28.4,7.19 27.3,7.19 | v0.94,10 v0.94,7.78 0.94,7.19 | v3.99,5.56 3.99,4.99 | 3.99,4.99 0.94,4.99 v0.94,5.56 | v5.66,5.56 5.66,4.99 | 5.66,4.99 3.99,4.99 | v7.32,5.56 7.32,4.99 | 7.32,4.99 5.66,4.99 | v9.82,5.56 9.82,4.99 | 9.82,4.99 7.32,4.99 | v12.32,5.56 12.32,4.99 | 12.32,4.99 9.82,4.99 | v14.82,5.56 14.82,4.99 | 14.82,4.99 12.32,4.99 | v16.48,5.56 16.48,4.99 | 16.48,4.99 14.82,4.99 | v18.98,5.56 18.98,4.99 | 18.98,4.99 16.48,4.99 | v20.64,5.56 20.64,4.99
  Bottom 0.2: 20.64,4.99 18.98,4.99 | v23.14,5.56 23.14,4.99 | 23.14,4.99 20.64,4.99 | v24.81,5.56 24.81,4.99 | 24.81,4.99 23.14,4.99 | v27.3,5.56 27.3,4.99 | 27.3,4.99 24.81,4.99 | v29.25,5.56 29.06,5.38 arc-45 28.13,4.99 27.3,4.99 | v27.3,12.22 27.3,11.69 | 27.3,11.69 28.39,11.69 arc45 28.95,11.92 v29.25,12.22 29.25,12.97 arc-45 29.78,14.65 v29.93,14.79 | 0.94,7.19 v0.94,5.56 | v29.25,3.34 28.85,2.94 arc-45 28.48,2.79 27.3,2.79 | 27.3,2.79 v27.3,3.34 | v24.81,3.34 24.81,2.79 | 24.81,2.79 27.3,2.79 | v23.14,3.34 23.14,2.79 | 23.14,2.79 24.81,2.79 | v20.64,3.34 20.64,2.79 | 20.64,2.79 23.14,2.79 | v18.98,3.34 18.98,2.79 | 18.98,2.79 20.64,2.79 | v16.48,3.34 16.48,2.79 | 16.48,2.79 18.98,2.79 | v14.82,3.34 14.82,2.79 | 14.82,2.79 16.48,2.79 | v12.32,3.34 12.32,2.79 | 12.32,2.79 14.82,2.79 | v9.82,3.34 9.82,2.79 | 9.82,2.79 12.32,2.79 | v7.32,3.34 7.32,2.79 | 7.32,2.79 9.82,2.79 | v5.66,3.34 5.66,2.79 | 5.66,2.79 7.32,2.79 | 3.99,2.79 5.66,2.79 | v3.99,3.34 3.99,2.79 | 3.99,2.79 1.63,2.79 arc-45 1.35,2.91 0.94,3.32 v0.94,5.56 | 5.66,9.49 4.03,9.49 | 4.03,9.49 0.94,9.49 v0.94,10 | v3.99,10 4.03,10 4.03,9.49 | v3.69,12.22 3.69,11.69 | 3.69,11.69 5.66,11.69 | 5.66,11.69 7.32,11.69 | 7.32,11.69 9.82,11.69 | 9.82,11.69 12.32,11.69 | 12.32,11.69 14.82,11.69 | 14.82,11.69 16.48,11.69 | 16.48,11.69 18.98,11.69 | 18.98,11.69 v18.98,12.22 | v5.66,12.22 5.66,11.69 | v7.32,12.22 7.32,11.69 | v9.82,12.22 9.82,11.69 | v12.32,12.22 12.32,11.69 | v14.82,12.22 14.82,11.69 | v16.48,12.22 16.48,11.69 | 23.14,11.69 20.64,11.69 | 20.64,11.69 18.98,11.69 | v20.64,12.22 20.64,11.69 | 1.8,10.66 LED14.VDD 0.94,10.77 | 0.94,10.77 v0.94,12.22 | 3.69,11.69 arc45 3.07,11.43 2.93,11.3 arc-45 2.68,11.19 2.13,11.19
  Bottom 0.4: 2.51,14.89 arc45 1.34,14.41 0.94,14.01 v0.94,12.22
  Bottom 0.406: 2.51,14.89 4.12,14.89 arc45 5.32,15.39 LEFT.3
  pour Bottom: 0.43,13.79 0.43,3.29 1.13,3.29 1.13,4.09 1.69,4.09 1.93,4.33 1.93,10.59 2.83,10.89 2.83,11.19 1.53,11.19 1.13,11.59 1.13,14.29

### Text on the board
bPlace: LOLRGB SHIELD
bNames: 4 | 14 | 15 | 27 | 26 | 25 | BAT | GND | 5V | 3V3 | VCC | DATA | @tinyledmatrix | rev3 '19-10 | RST | GND | 23 | 19 | 18 | 5 | 22 | 21 | 32 | 33